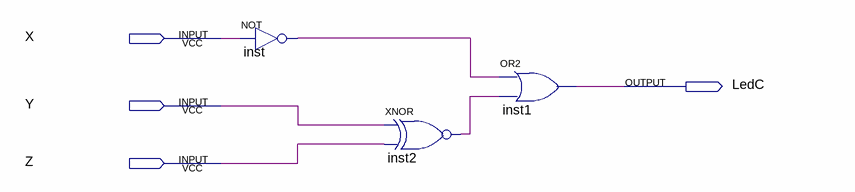
[diagram p0: schematic sheet]
// Quartus schematic LEDc.bdf as structural Verilog: 3 symbols, 4 pins
module LEDc (
  input  X,
  input  Y,
  input  Z,
  output LedC
);

  wire inst2_out, inst_out;

  not inst (inst_out, X);
  xnor inst2 (inst2_out, Y, Z);
  or inst1 (LedC, inst_out, inst2_out);
endmodule
